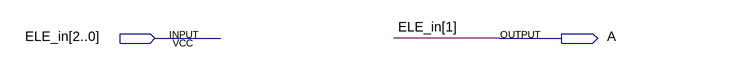
[diagram p0: schematic sheet]
// Quartus schematic DECOD_ELE_A.bdf as structural Verilog: 0 symbols, 2 pins
module DECOD_ELE_A (
  input  [2:0] ELE_in,
  output A
);


  assign A = ELE_in[1];
endmodule
